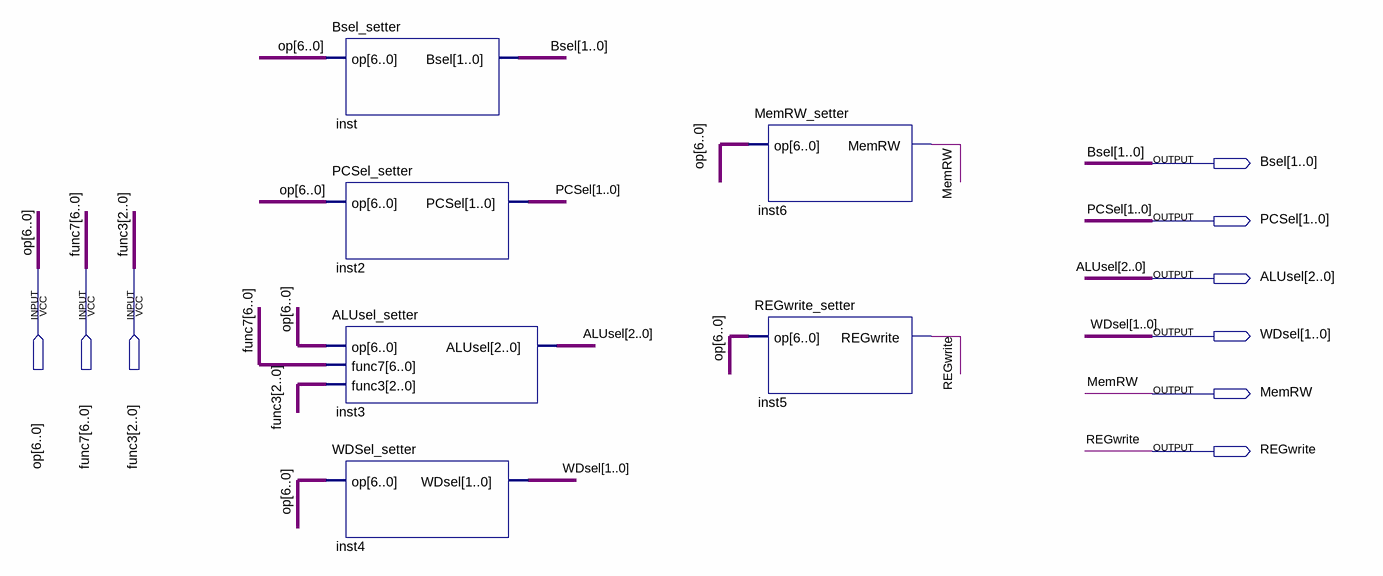
[diagram p0: schematic sheet]
// Quartus schematic control_unit.bdf as structural Verilog: 6 symbols, 9 pins
module control_unit (
  input  [6:0] op,
  input  [6:0] func7,
  input  [2:0] func3,
  output [1:0] Bsel,
  output [1:0] PCSel,
  output [2:0] ALUsel,
  output [1:0] WDsel,
  output MemRW,
  output REGwrite
);

  Bsel_setter inst (.op(op), .Bsel(Bsel));
  PCSel_setter inst2 (.op(op), .PCSel(PCSel));
  ALUsel_setter inst3 (.op(op), .func7(func7), .func3(func3), .ALUsel(ALUsel));
  WDSel_setter inst4 (.op(op), .WDsel(WDsel));
  MemRW_setter inst6 (.op(op), .MemRW(MemRW));
  REGwrite_setter inst5 (.op(op), .REGwrite(REGwrite));
endmodule
